# Altium project ArakDisCharger.PrjPcb (part 1 of 2)
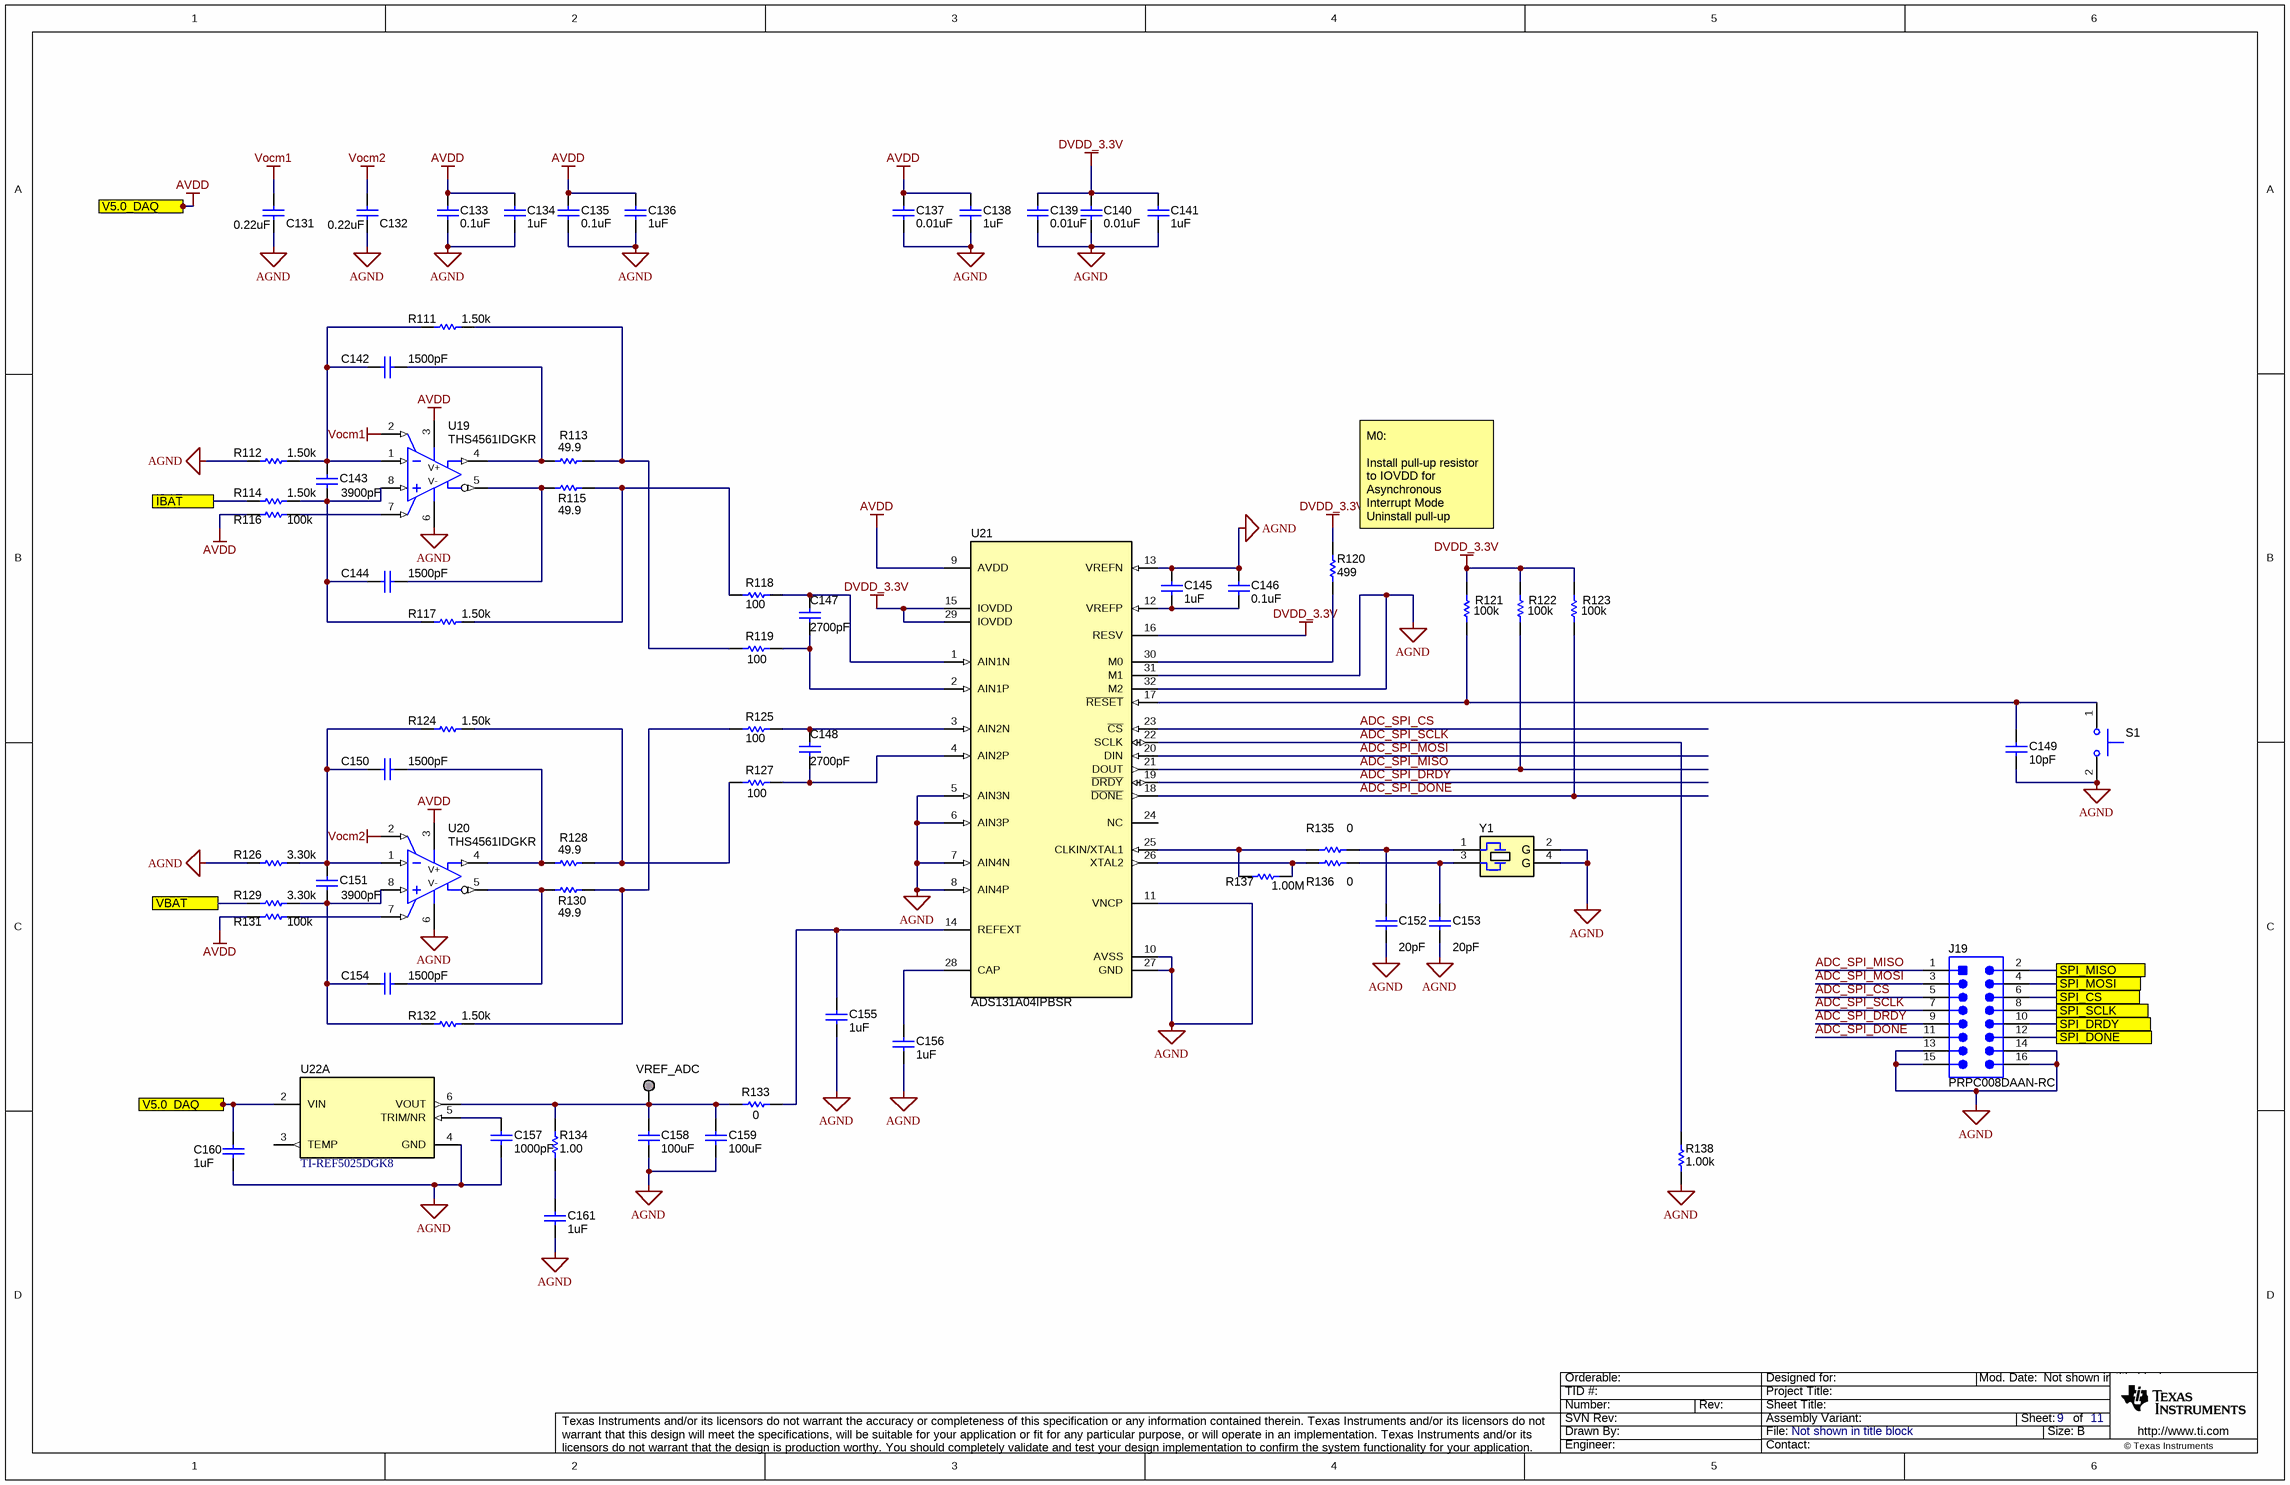
[diagram p0: Arak-ADC.SchDoc]
6 sheets, 167 parts. Net scope: flat (ports and power ports of the same name join across sheets).
Sheets:
  Arak-ADC.SchDoc
  Arak-AnalogueFrontend.SchDoc
  Arak-DAC.SchDoc
  Arak-Mux.SchDoc
  Arak-18650-Holder.SchDoc
  Arak-SlaveMux.SchDoc

## Sheet Arak-ADC.SchDoc
size 431 x 279 mm; Date: Not shown in title block; ApprovedBy: Not shown in title block; CheckedBy: Not shown in title block; Author: Not shown in title block; CompanyName: Not shown in title block; Engineer: Not shown in title block; Organization: Not shown in title block; Address1: Not shown in title block; Address2: Not shown in title block; Address3: Not shown in title block; Address4: Not shown in title block; DocumentNumber: 9; Revision: Use project parameter SCH_Rev; SheetNumber: 9; SheetTotal: 11; PageSetup: Record=PageOptions|CenterHorizontal=True|CenterVertical=True|PrintScale=1.00|XCorrection=1.00|YCorrection=1.00|PrintKind=0|BorderSize=5000000|LeftOffset=0|BottomOffset=0|Orientation=2|PaperLength=1000|PaperWidth=1000|Scale=100|PaperSource=15|PrintQuality=600|MediaType=1|DitherType=10|PaperKind=Letter|PrintScaleMode=1; CurrentTime: Not shown in title block; CurrentDate: Not shown in title block; Time: Not shown in title block; DocumentFullPathAndName: Not shown in title block; DocumentName: Not shown in title block; ModifiedDate: Not shown in title block; ImagePath: Not shown in title block

### Parts
C131  ValueDisplayed: 0.22uF  [0603]  (hidden comment: Capacitor)
C132  ValueDisplayed: 0.22uF  [0603]  (hidden comment: Capacitor)
C133  ValueDisplayed: 0.1uF  [0603]  (hidden comment: Capacitor)
C134  ValueDisplayed: 1uF  [0603]  (hidden comment: Capacitor)
C135  ValueDisplayed: 0.1uF  [0603]  (hidden comment: Capacitor)
C136  ValueDisplayed: 1uF  [0603]  (hidden comment: Capacitor)
C137  ValueDisplayed: 0.01uF  [0603]  (hidden comment: Capacitor)
C138  ValueDisplayed: 1uF  [0603]  (hidden comment: Capacitor)
C139  ValueDisplayed: 0.01uF  [0603]  (hidden comment: Capacitor)
C140  ValueDisplayed: 0.01uF  [0603]  (hidden comment: Capacitor)
C141  ValueDisplayed: 1uF  [0603]  (hidden comment: Capacitor)
C142  ValueDisplayed: 1500pF  [0603]  (hidden comment: Capacitor)
C143  ValueDisplayed: 3900pF  [0603]  (hidden comment: GRM188R72A392KA01D)
C144  ValueDisplayed: 1500pF  [0603]  (hidden comment: Capacitor)
C145  ValueDisplayed: 1uF  [0603]  (hidden comment: Capacitor)
C146  ValueDisplayed: 0.1uF  [0603]  (hidden comment: Capacitor)
C147  ValueDisplayed: 2700pF  [0603]  (hidden comment: Capacitor)
C148  ValueDisplayed: 2700pF  [0603]  (hidden comment: Capacitor)
C149  ValueDisplayed: 10pF  [0603]  (hidden comment: Capacitor)
C150  ValueDisplayed: 1500pF  [0603]  (hidden comment: Capacitor)
C151  ValueDisplayed: 3900pF  [0603]  (hidden comment: GRM188R72A392KA01D)
C152  ValueDisplayed: 20pF  [0603]  (hidden comment: GRM1885C1H200JA01D)
C153  ValueDisplayed: 20pF  [0603]  (hidden comment: GRM1885C1H200JA01D)
C154  ValueDisplayed: 1500pF  [0603]  (hidden comment: Capacitor)
C155  ValueDisplayed: 1uF  [0603]  (hidden comment: Capacitor)
C156  ValueDisplayed: 1uF  [0603]  (hidden comment: Capacitor)
C157  ValueDisplayed: 1000pF  [0603]  (hidden comment: Capacitor)
C158  ValueDisplayed: 100uF  [1206_190]  (hidden comment: Capacitor)
C159  ValueDisplayed: 100uF  [1206_190]  (hidden comment: Capacitor)
C160  ValueDisplayed: 1uF  [0603]  (hidden comment: Capacitor)
C161  ValueDisplayed: 1uF  [0603]  (hidden comment: Capacitor)
J19  PRPC008DAAN-RC  [Sullins_xxxC008DAAN]
R111  ValueDisplayed: 1.50k  [0603]  (hidden comment: RC0603FR-071K5L)
R112  ValueDisplayed: 1.50k  [0603]  (hidden comment: RC0603FR-071K5L)
R113  ValueDisplayed: 49.9  [0603]  (hidden comment: Resistor)
R114  ValueDisplayed: 1.50k  [0603]  (hidden comment: RC0603FR-071K5L)
R115  ValueDisplayed: 49.9  [0603]  (hidden comment: Resistor)
R116  ValueDisplayed: 100k  [0603]  (hidden comment: Resistor)
R117  ValueDisplayed: 1.50k  [0603]  (hidden comment: RC0603FR-071K5L)
R118  ValueDisplayed: 100  [0603]  (hidden comment: Resistor)
R119  ValueDisplayed: 100  [0603]  (hidden comment: Resistor)
R120  ValueDisplayed: 499  [0603]  (hidden comment: Resistor)
R121  ValueDisplayed: 100k  [0603]  (hidden comment: Resistor)
R122  ValueDisplayed: 100k  [0603]  (hidden comment: Resistor)
R123  ValueDisplayed: 100k  [0603]  (hidden comment: Resistor)
R124  ValueDisplayed: 1.50k  [0603]  (hidden comment: RC0603FR-071K5L)
R125  ValueDisplayed: 100  [0603]  (hidden comment: Resistor)
R126  ValueDisplayed: 3.30k  [0603]  (hidden comment: RC0603FR-073K3L)
R127  ValueDisplayed: 100  [0603]  (hidden comment: Resistor)
R128  ValueDisplayed: 49.9  [0603]  (hidden comment: Resistor)
R129  ValueDisplayed: 3.30k  [0603]  (hidden comment: RC0603FR-073K3L)
R130  ValueDisplayed: 49.9  [0603]  (hidden comment: Resistor)
R131  ValueDisplayed: 100k  [0603]  (hidden comment: Resistor)
R132  ValueDisplayed: 1.50k  [0603]  (hidden comment: RC0603FR-071K5L)
R133  ValueDisplayed: 0  [0603]  (hidden comment: Resistor)
R134  ValueDisplayed: 1.00  [0603]  (hidden comment: Resistor)
R135  ValueDisplayed: 0  [0603]  (hidden comment: Resistor)
R136  ValueDisplayed: 0  [0603]  (hidden comment: Resistor)
R137  ValueDisplayed: 1.00M  [0603]  (hidden comment: Resistor)
R138  ValueDisplayed: 1.00k  [0603]  (hidden comment: Resistor)
S1  Switch_PushButton  [SW_TL1015AF160QG]  (value not drawn)
U19  THS4561IDGKR  [DGK0008A_N]
U20  THS4561IDGKR  [DGK0008A_N]
U21  ADS131A04IPBSR  [PBS0032A_L]
U22  TI-REF5025DGK8  [DGK0008A_N]  (part A of 2)
VREF_ADC  Pogo Pad  [PogoPad]  (value not drawn)  (no BOM)
Y1  XTAL_4P_13_G24  [CTS_407]  (value not drawn)

### Ports
IBAT, SPI_CS, SPI_DONE, SPI_DRDY, SPI_MISO, SPI_MOSI, SPI_SCLK, V5.0_DAQ, VBAT

### Nets
AGND: C131.2 C132.2 C133.2 C134.2 C135.2 C136.2 C137.2 C138.2 C139.2 C140.2 C141.2 C145.1 C146.1 C149.1 C152.2 C153.2 C155.2 C156.2 C157.2 C158.2 C159.2 C160.2 C161.2 J19.13 J19.14 J19.15 J19.16 R112.1 R126.1 R138.1 S1.2 U19.6(VS-) U20.6(VS-) U21.5(AIN3N) U21.6(AIN3P) U21.7(AIN4N) U21.8(AIN4P) U21.10(AVSS) U21.11(VNCP) U21.13(VREFN) U21.27(GND) U21.31(M1) U21.32(M2) U22.4(GND) Y1.2(GND) Y1.4(GND)
AVDD: C133.1 C134.1 C135.1 C136.1 C137.1 C138.1 C160.1 R116.2 R131.2 U19.3(VS+) U20.3(VS+) U21.9(AVDD) U22.2(VIN) ; port V5.0_DAQ
DVDD_3.3V: C139.1 C140.1 C141.1 R120.2 R121.2 R122.2 R123.2 U21.15(IOVDD) U21.16(RESV) U21.29(IOVDD)
Vocm1: C131.1 U19.2(VOCM)
Vocm2: C132.1 U20.2(VOCM)
ADC_SPI_CS: J19.5 U21.23(~{CS})
ADC_SPI_DONE: J19.11 R123.1 U21.18(~{DONE})
ADC_SPI_DRDY: J19.9 U21.19(~{DRDY})
ADC_SPI_MISO: J19.1 R122.1 U21.21(DOUT)
ADC_SPI_MOSI: J19.3 U21.20(DIN)
ADC_SPI_SCLK: J19.7 R138.2 U21.22(SCLK)
NetC8_2: R129.1 ; port VBAT
NetC113_2: R114.1 ; port IBAT
NetC142_1: C142.1 C143.1 R111.1 R112.2 U19.1(VIN-)
NetC142_2: C142.2 R113.1 U19.4(VOUT+)
NetC143_2: C143.2 C144.1 R114.2 R117.1 U19.8(VIN+)
NetC144_2: C144.2 R115.1 U19.5(VOUT-)
NetC145_2: C145.2 C146.2 U21.12(VREFP)
NetC147_1: C147.1 R118.2 U21.1(AIN1N)
NetC147_2: C147.2 R119.2 U21.2(AIN1P)
NetC148_1: C148.1 R125.2 U21.3(AIN2N)
NetC148_2: C148.2 R127.2 U21.4(AIN2P)
NetC149_2: C149.2 R121.1 S1.1 U21.17(~{RESET})
NetC150_1: C150.1 C151.1 R124.1 R126.2 U20.1(VIN-)
NetC150_2: C150.2 R128.1 U20.4(VOUT+)
NetC151_2: C151.2 C154.1 R129.2 R132.1 U20.8(VIN+)
NetC152_1: C152.1 R135.2 Y1.1
NetC153_1: C153.1 R136.1 Y1.3
NetC154_2: C154.2 R130.1 U20.5(VOUT-)
NetC155_1: C155.1 R133.2 U21.14(REFEXT)
NetC156_1: C156.1 U21.28(CAP)
NetC157_1: C157.1 U22.5(TRIM/NR)
NetC158_1: C158.1 C159.1 R133.1 R134.2 U22.6(VOUT) VREF_ADC.1
NetC161_1: C161.1 R134.1
NetJ19_2: J19.2 ; port SPI_MISO
NetJ19_4: J19.4 ; port SPI_MOSI
NetJ19_6: J19.6 ; port SPI_CS
NetJ19_8: J19.8 ; port SPI_SCLK
NetJ19_10: J19.10 ; port SPI_DRDY
NetJ19_12: J19.12 ; port SPI_DONE
NetR111_2: R111.2 R113.2 R119.1
NetR115_2: R115.2 R117.2 R118.1
NetR116_1: R116.1 U19.7(~{PD})
NetR120_1: R120.1 U21.30(M0)
NetR124_2: R124.2 R127.1 R128.2
NetR125_1: R125.1 R130.2 R132.2
NetR131_1: R131.1 U20.7(~{PD})
NetR135_1: R135.1 R137.2 U21.25(CLKIN/XTAL1)
NetR136_2: R136.2 R137.1 U21.26(XTAL2)

Not connected (* = marked no-connect by the designer): U21 24(NC); U22 3(TEMP)

### Notes on the sheet
- (near R120) M0:
  Install pull-up resistor to IOVDD for Asynchronous Interrupt Mode
  Uninstall pull-up resistor to leave M0 floating for Synchronous Slave Mode
- Drawn By:
- SVN Rev:
- Number:
- TID #:
- Orderable:
- Rev:
- Sheet Title:
- File:
- Project Title:
- Designed for:
- Assembly Variant:
- Mod. Date:
- Sheet:
- Size:
- of
- B
- http://www.ti.com
- Texas Instruments and/or its licensors do not warrant the accuracy or completeness of this specification or any information contained therein. Texas Instruments and/or its licensors do not warrant that this design will meet the specifications, will be suitable for your application or fit for any particular purpose, or will operate in an implementation. Texas Instruments and/or its licensors do not warrant that the design is production worthy. You should completely validate and test your design implementation to confirm the system functionality for your application.
- Engineer:
- Contact:
- © Texas Instruments
- (in symbol CMP-0004606-3) G
- (in symbol CMP-0074888-1) V+; V-

### Library data of the parts
C131 C132 = CMP-0006903-4: CAP, CERM, 0.22 uF, 16 V, +/- 10%, X7R, 0603; PartNumber: C0603C224K4RACTU; Manufacturer: Kemet; Polarized: N; Value: 0.22uF; U/M: EA; Cap_F: 220nF; Value1: Unknown; VDC_V: 16V; TaMin_C: -55°C; TaMax_C: 125°C; AEC Category: Q200; SizeArea_mm2: 1.28; SizeAreaWB_mm2: 4.68; SizeX_mm: 1.6; SizeY_mm: 0.8; SizeZ_mm: 1; CompType: Capacitor; PackageReference: 0603; RoHS: Y; Tolerance_%: 10%; Value2: 16V; MountType: SMT; Technology: Ceramic; TempCo: X7R; Cap_Case: 0603; Published: 2008-06-19; Publisher: Texas Instruments; LatestRevisionDate: 2017-03-09; ComponentLink1Description: Datasheet link; ComponentLink1URL: http://www.kemet.com/kemet/web/homepage/kechome.nsf/vapubfiles/F3102_Y5V.pdf/$file/F3102_Y5V.pdf; Supplier 1: Digi-Key; Supplier Part Number 1: 399-5619-1-ND; Supplier 2: Mouser; Supplier Part Number 2: 80-C0603C224K4R; Supplier 3: Farnell; Supplier Part Number 3: 1650007; AEC Qualified: ?
C133 C135 C146 = CMP-0006752-5: CAP, CERM, 0.1 uF, 25 V, +/- 5%, X7R, 0603; PartNumber: 06033C104JAT2A; Manufacturer: AVX; Polarized: N; Value: 0.1uF; U/M: EA; Cap_F: 100nF; ESR_ohm: 0.05; Value1: 0.05 ohm; VDC_V: 25V; TaMin_C: -55°C; TaMax_C: 125°C; AEC Category: Q200; SizeArea_mm2: 1.28; SizeAreaWB_mm2: 4.68; SizeX_mm: 1.6; SizeY_mm: 0.8; SizeZ_mm: 1; CompType: Capacitor; PackageReference: 0603; RoHS: Y; Tolerance_%: 5%; Value2: 25V; MountType: SMT; Technology: Ceramic; TempCo: X7R; Cap_Case: 0603; Published: 2008-06-19; Publisher: Texas Instruments; LatestRevisionDate: 2017-03-09; ComponentLink1Description: Datasheet link; ComponentLink1URL: http://datasheets.avx.com/X7RDielectric.pdf; Supplier 1: Digi-Key; Supplier Part Number 1: 478-3713-1-ND; Supplier 2: Mouser; Supplier Part Number 2: 581-06033C104JAT2A; Supplier 3: Farnell; Supplier Part Number 3: 1740614; AEC Qualified: N; AEC Grade: N/A
C134 C136 C138 C141 C145 C155 C156 C160 C161 = CMP-0007405-4: CAP, CERM, 1 uF, 25 V, +/- 10%, X7R, 0603; PartNumber: GRM188R71E105KA12D; Manufacturer: MuRata; Polarized: N; Value: 1uF; U/M: EA; Cap_F: 1µF; Value1: Unknown; VDC_V: 25V; TaMin_C: -55°C; TaMax_C: 125°C; AEC Category: Q200; SizeArea_mm2: 1.28; SizeAreaWB_mm2: 4.68; SizeX_mm: 1.6; SizeY_mm: 0.8; SizeZ_mm: 1; CompType: Capacitor; PackageReference: 0603; RoHS: Y; Tolerance_%: 10%; Value2: 25V; MountType: SMT; Technology: Ceramic; TempCo: X7R; Cap_Case: 0603; Published: 2008-06-19; Publisher: Texas Instruments; LatestRevisionDate: 2017-03-09; ComponentLink1Description: Datasheet link; ComponentLink1URL: http://search.murata.co.jp/Ceramy/PnsearchViewAction.do?HnOFG=ON&HnNFG=ON&SEL_CNT=50&sLang=en&sKey=GRM188R71E105KA12D&x=9&y=9&search=startwith; Supplier 1: Digi-Key; Supplier Part Number 1: 490-5307-1-ND; Supplier 2: Mouser; Supplier Part Number 2: 81-GRM188R71E105KA2D; Supplier 3: Farnell; Supplier Part Number 3: 1735540; AEC Qualified: ?
C137 C139 C140 = CMP-0006727-4: CAP, CERM, 0.01 uF, 100 V, +/- 10%, X7R, 0603; PartNumber: 06031C103KAT2A; Manufacturer: AVX; Polarized: N; Value: 0.01uF; U/M: EA; Cap_F: 10nF; ESR_ohm: 0.098; Value1: 0.098 ohm; VDC_V: 100V; TaMin_C: -55°C; TaMax_C: 125°C; AEC Category: Q200; SizeArea_mm2: 1.28; SizeAreaWB_mm2: 4.68; SizeX_mm: 1.6; SizeY_mm: 0.8; SizeZ_mm: 1; CompType: Capacitor; PackageReference: 0603; RoHS: Y; Tolerance_%: 10%; Value2: 100V; MountType: SMT; Technology: Ceramic; TempCo: X7R; Cap_Case: 0603; Published: 2008-06-19; Publisher: Texas Instruments; LatestRevisionDate: 2017-03-09; ComponentLink1Description: Datasheet link; ComponentLink1URL: http://datasheets.avx.com/X7RDielectric.pdf; Supplier 1: Digi-Key; Supplier Part Number 1: 478-1205-1-ND; Supplier 2: Newark; Supplier Part Number 2: 96K4758; Supplier 3: Mouser; Supplier Part Number 3: 581-06031C103K; AEC Qualified: N; AEC Grade: N/A
C142 C144 C150 C154 = CMP-0006732-4: CAP, CERM, 1500 pF, 100 V, +/- 5%, X7R, 0603; PartNumber: 06031C152JAT2A; Manufacturer: AVX; Polarized: N; Value: 1500pF; U/M: EA; Cap_F: 1.5nF; ESR_ohm: 2.29d; Value1: 0.229 ohm; VDC_V: 100V; TaMin_C: -55°C; TaMax_C: 125°C; AEC Category: Q200; SizeArea_mm2: 1.28; SizeAreaWB_mm2: 4.68; SizeX_mm: 1.6; SizeY_mm: 0.8; SizeZ_mm: 1; CompType: Capacitor; PackageReference: 0603; RoHS: Y; Tolerance_%: 5%; Value2: 100V; MountType: SMT; Technology: Ceramic; TempCo: X7R; Cap_Case: 0603; Published: 2008-06-19; Publisher: Texas Instruments; LatestRevisionDate: 2017-03-09; ComponentLink1Description: Datasheet link; ComponentLink1URL: http://datasheets.avx.com/X7RDielectric.pdf; Supplier 1: Digi-Key; Supplier Part Number 1: 478-3703-1-ND; Supplier 2: Newark; Supplier Part Number 2: 96M1240; Supplier 3: Mouser; Supplier Part Number 3: 581-06031C152JAT2A; AEC Qualified: N; AEC Grade: N/A
C143 C151 = CMP-0007481-5: CAP, CERM, 3900 pF, 100 V, +/- 10%, X7R, 0603; Manufacturer: MuRata; TaMin_C: -55°C; Polarized: N; SizeAreaWB_mm2: 4.68; Value1: Unknown; U/M: EA; Value: 3900pF; TaMax_C: 125°C; SizeZ_mm: 1; SizeX_mm: 1.6; SizeY_mm: 0.8; Value2: 100V; SizeArea_mm2: 1.28; CompType: Capacitor; Cap_F: 3.9nF; AEC Category: Q200; Supplier Part Number 2: 81-GRM188R72A392KA1D; Publisher: Texas Instruments; Supplier 2: Mouser; TempCo: X7R; Published: 2008-06-19; RoHS: Y; MountType: SMT; Supplier 1: Digi-Key; PackageReference: 0603; Tolerance_%: 10%; Cap_Case: 0603; LatestRevisionDate: 2017-03-09; PartNumber: GRM188R72A392KA01D; AEC Qualified: ?; VDC_V: 100V; ComponentLink1Description: Datasheet link; Supplier Part Number 1: GRM188R72A392KA01D-ND; Technology: Ceramic; ComponentLink1URL: http://search.murata.co.jp/Ceramy/PnsearchViewAction.do?HnOFG=ON&HnNFG=ON&SEL_CNT=50&sLang=en&sKey=GRM188R72A392KA01D&x=9&y=9&search=startwith
C147 C148 = CMP-0007204-4: CAP, CERM, 2700 pF, 50 V, +/- 5%, C0G/NP0, 0603; PartNumber: GRM1885C1H272JA01D; Manufacturer: MuRata; Polarized: N; Value: 2700pF; U/M: EA; Cap_F: 2.7nF; Value1: Unknown; VDC_V: 50V; TaMin_C: -55°C; TaMax_C: 125°C; AEC Category: Q200; SizeArea_mm2: 1.28; SizeAreaWB_mm2: 4.68; SizeX_mm: 1.6; SizeY_mm: 0.8; SizeZ_mm: 1; CompType: Capacitor; PackageReference: 0603; RoHS: Y; Tolerance_%: 5%; Value2: 50V; MountType: SMT; Technology: Ceramic; TempCo: C0G/NP0; Cap_Case: 0603; Published: 2008-06-19; Publisher: Texas Instruments; LatestRevisionDate: 2017-03-09; ComponentLink1Description: Datasheet link; ComponentLink1URL: http://search.murata.co.jp/Ceramy/PnsearchViewAction.do?HnOFG=ON&HnNFG=ON&SEL_CNT=50&sLang=en&sKey=GRM1885C1H272JA01D&x=9&y=9&search=startwith; Supplier 1: Digi-Key; Supplier Part Number 1: 490-3283-1-ND; Supplier 2: Mouser; Supplier Part Number 2: 81-GRM185C1H272JA01D; AEC Qualified: ?
C149 = CMP-0006761-4: CAP, CERM, 10 pF, 50 V, +/- 5%, C0G/NP0, 0603; PartNumber: 06035A100JAT2A; Manufacturer: AVX; Polarized: N; Value: 10pF; U/M: EA; ESR_ohm: 4.03d; Value1: 0.403 ohm; VDC_V: 50V; TaMin_C: -55°C; TaMax_C: 125°C; AEC Category: Q200; SizeArea_mm2: 1.28; SizeAreaWB_mm2: 4.68; SizeX_mm: 1.6; SizeY_mm: 0.8; SizeZ_mm: 1; CompType: Capacitor; PackageReference: 0603; RoHS: Y; Cap_F: 10pF; Tolerance_%: 5%; Value2: 50V; MountType: SMT; Technology: Ceramic; TempCo: C0G/NP0; Cap_Case: 0603; Published: 2008-06-19; Publisher: Texas Instruments; LatestRevisionDate: 2017-03-09; ComponentLink1Description: Datasheet link; ComponentLink1URL: http://datasheets.avx.com/C0GNP0-Dielectric.pdf; Supplier 1: Digi-Key; Supplier Part Number 1: 478-1163-1-ND; Supplier 2: Newark; Supplier Part Number 2: 17C6435; Supplier 3: Mouser; Supplier Part Number 3: 581-06035A100J; AEC Qualified: N; AEC Grade: N/A
C152 C153 = CMP-0007193-4: CAP, CERM, 20 pF, 50 V, +/- 5%, C0G/NP0, 0603; Manufacturer: MuRata; TaMin_C: -55°C; Polarized: N; SizeAreaWB_mm2: 4.68; Value1: Unknown; U/M: EA; Value: 20pF; TaMax_C: 125°C; SizeZ_mm: 1; SizeX_mm: 1.6; SizeY_mm: 0.8; Value2: 50V; SizeArea_mm2: 1.28; CompType: Capacitor; AEC Category: Q200; Supplier Part Number 2: 81-GRM39C200J50; Publisher: Texas Instruments; Supplier 2: Mouser; TempCo: C0G/NP0; Published: 2008-06-19; RoHS: Y; MountType: SMT; Supplier 1: Digi-Key; PackageReference: 0603; Tolerance_%: 5%; Cap_Case: 0603; LatestRevisionDate: 2017-03-09; PartNumber: GRM1885C1H200JA01D; AEC Qualified: ?; Cap_F: 20pF; VDC_V: 50V; ComponentLink1Description: Datasheet link; Supplier Part Number 1: 490-1410-1-ND; Technology: Ceramic; ComponentLink1URL: http://search.murata.co.jp/Ceramy/PnsearchViewAction.do?HnOFG=ON&HnNFG=ON&SEL_CNT=50&sLang=en&sKey=GRM1885C1H200JA01D&x=9&y=9&search=startwith
C157 = CMP-0006723-4: CAP, CERM, 1000 pF, 100 V, +/- 5%, X7R, 0603; PartNumber: 06031C102JAT2A; Manufacturer: AVX; Polarized: N; Value: 1000pF; U/M: EA; Cap_F: 1nF; ESR_ohm: 2.76d; Value1: 0.276 ohm; VDC_V: 100V; TaMin_C: -55°C; TaMax_C: 125°C; AEC Category: Q200; SizeArea_mm2: 1.28; SizeAreaWB_mm2: 4.68; SizeX_mm: 1.6; SizeY_mm: 0.8; SizeZ_mm: 1; CompType: Capacitor; PackageReference: 0603; RoHS: Y; Tolerance_%: 5%; Value2: 100V; MountType: SMT; Technology: Ceramic; TempCo: X7R; Cap_Case: 0603; Published: 2008-06-19; Publisher: Texas Instruments; LatestRevisionDate: 2017-03-09; ComponentLink1Description: Datasheet link; ComponentLink1URL: http://datasheets.avx.com/X7RDielectric.pdf; Supplier 1: Digi-Key; Supplier Part Number 1: 478-3698-1-ND; Supplier 2: Newark; Supplier Part Number 2: 96M1234; Supplier 3: Mouser; Supplier Part Number 3: 581-06031C102J; AEC Qualified: N; AEC Grade: N/A
C158 C159 = CMP-0008649-2: CAP, CERM, 100 uF, 10 V, +/- 20%, X5R, 1206_190; PartNumber: C3216X5R1A107M160AC; Manufacturer: TDK; Polarized: N; Value: 100uF; U/M: EA; Cap_F: 100µF; ESR_ohm: 2.838m; Value1: 0.002838 ohm; VDC_V: 10V; IRMS_A: 4.30694A; TaMin_C: -55°C; TaMax_C: 85°C; AEC Category: Q200; SizeArea_mm2: 5.12; SizeAreaWB_mm2: 10.92; SizeX_mm: 3.2; SizeY_mm: 1.6; SizeZ_mm: 1.9; CompType: Capacitor; PackageReference: 1206_190; RoHS: Y; Tolerance_%: 20%; Value2: 10V; MountType: SMT; Technology: Ceramic; TempCo: X5R; Cap_Case: 1206_190; Published: 2008-06-19; Publisher: Texas Instruments; LatestRevisionDate: 2017-03-09; ComponentLink1Description: Datasheet link; ComponentLink1URL: https://product.tdk.com/en/search/capacitor/ceramic/mlcc/info?part_no=C3216X5R1A107M160AC; Supplier 1: Digi-Key; Supplier Part Number 1: 445-6007-1-ND; Supplier 2: Newark; Supplier Part Number 2: 12T1945; Supplier 3: Mouser; Supplier Part Number 3: 810-C3216X5R1A107M; AEC Qualified: N; AEC Grade: N/A
J19 = CMP-0054590-1: Header, 2.54mm, 8x2, Gold, TH; Manufacturer: Sullins Connector Solutions; CNHeader: TRUE; Shrouded: N; Gender: Male; Row_Count: 2; RowSpacing_mm: 2.54; CT: FALSE; ComponentLink1URL: http://sullinscorp.com/drawings/294___R__C_____D___N-RC,_11636.pdf; ClassName: Header; Publisher: Texas Instruments; Color: Black; RoHS: Y; MountType: TH; Supplier 1: Digi-Key; PackageReference: Header, 2.54mm, 8x2, TH; PinCount: 16; CompType: Header; LatestRevisionDate: 26/05/2017; PartNumber: PRPC008DAAN-RC; Orientation: Vertical; ComponentLink1Description: Datasheet URL; Supplier Part Number 1: S2011EC-08-ND; Pitch_mm: 2.54; ContactFinish: Gold
R111 R112 R114 R117 R124 = CMP-0022883-3: RES, 1.50 k, 1%, 0.1 W, 0603; Manufacturer: Yageo America; Power_W: 100mW; TempCo: 200 ppm/C; Value_Code: 1k50; U/M: EA; Value: 1.50k; EIA_Code: E96; Res_ohm: 1.5k; SizeX_mm: 1.6; SizeY_mm: 0.8; SizeZ_mm: 1; Value2: 0.1W; SizeArea_mm2: 1.28; CompType: Resistor; VDC_V: 150V; AEC Category: Q200; Supplier Part Number 2: 603-RC0603FR-071K5L; Publisher: Texas Instruments; Supplier 2: Mouser; Supplier Part Number 3: 9238506; Supplier 3: Farnell; Published: 2008-06-26; RoHS: Y; Value1: 1%; MountType: SMT; Supplier 1: Digi-Key; PackageReference: 0603; Tolerance_%: 1%; LatestRevisionDate: 2017-03-09; PartNumber: RC0603FR-071K5L; AEC Qualified: ?; ComponentLink1Description: Datasheet link; Supplier Part Number 1: 311-1.50KHRCT-ND; Technology: Thick Film; ComponentLink1URL: http://www.yageo.com/pdf/Pu-RC0603_51_PbFree_L_2.pdf
R113 R115 R128 R130 = CMP-0022448-4: RES, 49.9, 1%, 0.1 W, AEC-Q200 Grade 0, 0603; PartNumber: CRCW060349R9FKEA; Manufacturer: Vishay-Dale; Value: 49.9; Value_Code: 49R9; Power_W: 100mW; Value2: 0.1W; VDC_V: 75V; TempCo: 100 ppm/C; EIA_Code: E96; AEC Category: Q200; AEC Qualified: Y; AEC Grade: 0; SizeArea_mm2: 1.28; SizeX_mm: 1.6; SizeY_mm: 0.8; SizeZ_mm: 1; CompType: Resistor; PackageReference: 0603; RoHS: E; Res_ohm: 49.9; Tolerance_%: 1%; Value1: 1%; MountType: SMT; Technology: Thick Film; ComponentLink1Description: Datasheet link; ComponentLink1URL: http://www.vishay.com/docs/20035/dcrcwe3.pdf; Supplier 1: Digi-Key; Supplier Part Number 1: 541-49.9HCT-ND; Supplier 2: Newark; Supplier Part Number 2: 52K8566; Supplier 3: Mouser; Supplier Part Number 3: 71-CRCW0603-49.9-E3
R116 R121-R123 R131 = CMP-0021990-4: RES, 100 k, 1%, 0.1 W, AEC-Q200 Grade 0, 0603; PartNumber: CRCW0603100KFKEA; Manufacturer: Vishay-Dale; Value: 100k; Power_W: 100mW; Value2: 0.1W; VDC_V: 75V; TempCo: 100 ppm/C; EIA_Code: E96; AEC Category: Q200; AEC Qualified: Y; AEC Grade: 0; SizeArea_mm2: 1.28; SizeX_mm: 1.6; SizeY_mm: 0.8; SizeZ_mm: 1; CompType: Resistor; PackageReference: 0603; RoHS: E; Res_ohm: 100k; Value_Code: 100k; Tolerance_%: 1%; Value1: 1%; MountType: SMT; Technology: Thick Film; ComponentLink1Description: Datasheet link; ComponentLink1URL: http://www.vishay.com/docs/20035/dcrcwe3.pdf; Supplier 1: Digi-Key; Supplier Part Number 1: 541-100KHCT-ND; Supplier 2: Newark; Supplier Part Number 2: 42K3668; Supplier 3: Mouser; Supplier Part Number 3: 71-CRCW0603-100K-E3
R118 R119 R125 R127 = CMP-0021991-4: RES, 100, 1%, 0.1 W, AEC-Q200 Grade 0, 0603; PartNumber: CRCW0603100RFKEA; Manufacturer: Vishay-Dale; Value: 100; Value_Code: 100R; Power_W: 100mW; Value2: 0.1W; VDC_V: 75V; TempCo: 100 ppm/C; EIA_Code: E96; AEC Category: Q200; AEC Qualified: Y; AEC Grade: 0; SizeArea_mm2: 1.28; SizeX_mm: 1.6; SizeY_mm: 0.8; SizeZ_mm: 1; CompType: Resistor; PackageReference: 0603; RoHS: E; Res_ohm: 100; Tolerance_%: 1%; Value1: 1%; MountType: SMT; Technology: Thick Film; ComponentLink1Description: Datasheet link; ComponentLink1URL: http://www.vishay.com/docs/20035/dcrcwe3.pdf; Supplier 1: Digi-Key; Supplier Part Number 1: 541-100HCT-ND; Supplier 2: Newark; Supplier Part Number 2: 52K8078; Supplier 3: Mouser; Supplier Part Number 3: 71-CRCW0603-100-E3
R120 = CMP-0022446-5: RES, 499, 1%, 0.1 W, AEC-Q200 Grade 0, 0603; PartNumber: CRCW0603499RFKEA; Manufacturer: Vishay-Dale; Value: 499; Value_Code: 499R; Power_W: 100mW; Value2: 0.1W; VDC_V: 75V; TempCo: 100 ppm/C; EIA_Code: E96; AEC Category: Q200; AEC Qualified: Y; AEC Grade: 0; SizeArea_mm2: 1.28; SizeX_mm: 1.6; SizeY_mm: 0.8; SizeZ_mm: 1; CompType: Resistor; PackageReference: 0603; RoHS: E; Res_ohm: 499; Tolerance_%: 1%; Value1: 1%; MountType: SMT; Technology: Thick Film; ComponentLink1Description: Datasheet link; ComponentLink1URL: http://www.vishay.com/docs/20035/dcrcwe3.pdf; Supplier 1: Digi-Key; Supplier Part Number 1: 541-499HCT-ND; Supplier 2: Newark; Supplier Part Number 2: 52K8569; Supplier 3: Mouser; Supplier Part Number 3: 71-CRCW0603-499-E3
R126 R129 = CMP-0023081-3: RES, 3.30 k, 1%, 0.1 W, 0603; Manufacturer: Yageo America; Power_W: 100mW; TempCo: 200 ppm/C; Value_Code: 3k30; U/M: EA; Value: 3.30k; Res_ohm: 3.3k; SizeX_mm: 1.6; SizeY_mm: 0.8; SizeZ_mm: 1; Value2: 0.1W; SizeArea_mm2: 1.28; VDC_V: 150V; AEC Category: Q200; Supplier Part Number 2: 603-RC0603FR-073K3L; Publisher: Texas Instruments; Supplier 2: Mouser; Supplier Part Number 3: 9238549; Supplier 3: Farnell; Published: 2008-06-26; RoHS: Y; Value1: 1%; MountType: SMT; Supplier 1: Digi-Key; PackageReference: 0603; Tolerance_%: 1%; CompType: Resistor; LatestRevisionDate: 2017-03-09; PartNumber: RC0603FR-073K3L; AEC Qualified: ?; ComponentLink1Description: Datasheet link; Supplier Part Number 1: 311-3.30KHRCT-ND; Technology: Thick Film; ComponentLink1URL: http://www.yageo.com/pdf/Pu-RC0603_51_PbFree_L_2.pdf
R132 = CMP-0022883-3: RES, 1.50 k, 1%, 0.1 W, 0603; Manufacturer: Yageo America; Power_W: 100mW; TempCo: 200 ppm/C; Value_Code: 1k50; U/M: EA; Value: 1.50k; EIA_Code: E96; Res_ohm: 1.5k; SizeX_mm: 1.6; SizeY_mm: 0.8; SizeZ_mm: 1; Value2: 0.1W; SizeArea_mm2: 1.28; VDC_V: 150V; AEC Category: Q200; Supplier Part Number 2: 603-RC0603FR-071K5L; Publisher: Texas Instruments; Supplier 2: Mouser; Supplier Part Number 3: 9238506; Supplier 3: Farnell; Published: 2008-06-26; RoHS: Y; Value1: 1%; MountType: SMT; Supplier 1: Digi-Key; PackageReference: 0603; Tolerance_%: 1%; CompType: Resistor; LatestRevisionDate: 2017-03-09; PartNumber: RC0603FR-071K5L; AEC Qualified: ?; ComponentLink1Description: Datasheet link; Supplier Part Number 1: 311-1.50KHRCT-ND; Technology: Thick Film; ComponentLink1URL: http://www.yageo.com/pdf/Pu-RC0603_51_PbFree_L_2.pdf
R133 R135 R136 = CMP-0025874-3: RES, 0, 5%, 0.1 W, 0603; PartNumber: ERJ-3GEY0R00V; Manufacturer: Panasonic; Value: 0; Value_Code: 0000; Power_W: 100mW; Value2: 0.1W; VDC_V: 50V; TempCo: 600 ppm/C; EIA_Code: E24; U/M: EA; AEC Category: Q200; SizeArea_mm2: 1.28; SizeX_mm: 1.6; SizeY_mm: 0.8; SizeZ_mm: 1; CompType: Resistor; PackageReference: 0603; RoHS: Y; Res_ohm: 0; Tolerance_%: 5%; Value1: 5%; MountType: SMT; Technology: Thick Film; Published: 2008-06-26; Publisher: Texas Instruments; LatestRevisionDate: 2017-03-09; ComponentLink1Description: Datasheet link; ComponentLink1URL: http://www.panasonic.com/industrial/components/pdf/AOA0000CE1.pdf; Supplier 1: Digi-Key; Supplier Part Number 1: P0.0GCT-ND; Supplier 2: Mouser; Supplier Part Number 2: 667-ERJ-3GEY0R00V; Supplier 3: Farnell; Supplier Part Number 3: 2059527; AEC Qualified: ?
R134 = CMP-0022170-4: RES, 1.00, 1%, 0.1 W, AEC-Q200 Grade 0, 0603; PartNumber: CRCW06031R00FKEA; Manufacturer: Vishay-Dale; Value: 1.00; Res_ohm: 1; Value_Code: 1R00; Power_W: 100mW; Value2: 0.1W; VDC_V: 75V; TempCo: 100 ppm/C; EIA_Code: E96; AEC Category: Q200; AEC Qualified: Y; AEC Grade: 0; SizeArea_mm2: 1.28; SizeX_mm: 1.6; SizeY_mm: 0.8; CompType: Resistor; PackageReference: 0603; RoHS: E; Tolerance_%: 1%; Value1: 1%; MountType: SMT; Technology: Thick Film; ComponentLink1Description: Datasheet link; ComponentLink1URL: http://www.vishay.com/docs/20035/dcrcwe3.pdf; Supplier 1: Newark; Supplier Part Number 1: 52K8059; Supplier 2: Mouser; Supplier Part Number 2: 71-CRCW06031R00FKEA; Supplier 3: Farnell; Supplier Part Number 3: 1616871; SizeZ_mm: 1
R137 = CMP-0022138-4: RES, 1.00 M, 1%, 0.1 W, AEC-Q200 Grade 0, 0603; PartNumber: CRCW06031M00FKEA; Manufacturer: Vishay-Dale; Value: 1.00Meg; Res_ohm: 1M; Value_Code: 1M00; Power_W: 100mW; Value2: 0.1W; VDC_V: 75V; TempCo: 100 ppm/C; EIA_Code: E96; AEC Category: Q200; AEC Qualified: Y; AEC Grade: 0; SizeArea_mm2: 1.28; SizeX_mm: 1.6; SizeY_mm: 0.8; SizeZ_mm: 1; CompType: Resistor; PackageReference: 0603; RoHS: E; Tolerance_%: 1%; Value1: 1%; MountType: SMT; Technology: Thick Film; ComponentLink1Description: Datasheet link; ComponentLink1URL: http://www.vishay.com/docs/20035/dcrcwe3.pdf; Supplier 1: Digi-Key; Supplier Part Number 1: 541-1.00MHCT-ND; Supplier 2: Newark; Supplier Part Number 2: 52K8053; Supplier 3: Mouser; Supplier Part Number 3: 71-CRCW0603-1.0M-E3
R138 = CMP-0022109-5: RES, 1.00 k, 1%, 0.1 W, AEC-Q200 Grade 0, 0603; PartNumber: CRCW06031K00FKEA; Manufacturer: Vishay-Dale; Value: 1.00k; Res_ohm: 1k; Value_Code: 1k00; Power_W: 100mW; Value2: 0.1W; VDC_V: 75V; TempCo: 100 ppm/C; EIA_Code: E96; AEC Category: Q200; AEC Qualified: Y; AEC Grade: 0; SizeArea_mm2: 1.28; SizeX_mm: 1.6; SizeY_mm: 0.8; SizeZ_mm: 1; CompType: Resistor; PackageReference: 0603; RoHS: E; Tolerance_%: 1%; Value1: 1%; MountType: SMT; Technology: Thick Film; ComponentLink1Description: Datasheet link; ComponentLink1URL: http://www.vishay.com/docs/20035/dcrcwe3.pdf; Supplier 1: Digi-Key; Supplier Part Number 1: 541-1.00KHCT-ND; Supplier 2: Newark; Supplier Part Number 2: 52K8015; Supplier 3: Mouser; Supplier Part Number 3: 71-CRCW0603-1.0K-E3
S1 = CMP-0002143-3: Switch, Tactile, SPST-NO, 0.05A, 12V, SMT; PartNumber: TL1015AF160QG; Manufacturer: E-Switch; SwitchFunction: Off-Mom; PositionCount: 1; CurrentRating_mA: 50A; MountType: SMT; ComponentLink1Description: Datasheet URL; ComponentLink1URL: http://spec.e-switch.com/P-J/P420000.pdf; RoHS: Y; Circuit: SPST-NO; VDC_V: 12V; Orientation: Top Actuated; CompType: Switch; PackageReference: Switch, 4.4x2x2.9 mm; Publisher: Texas Instruments; LatestRevisionDate: 2017-03-09; Supplier 1: Digi-Key; Supplier Part Number 1: EG4344CT-ND; Supplier 2: Newark; Supplier Part Number 2: 15N4458; Supplier 3: Mouser; Supplier Part Number 3: 612-TL1015AF
U19 U20 = CMP-0074888-1: Low-Power, High Supply Range, 60-MHz, Fully Differential Amplifier, DGK0008A (VSSOP-8); Alternate PartNumber: THS4561IDGKT; Alternate Manufacturer: Texas Instruments; SizeAreaWB_mm2: 35.955; U/M: EA; SizeZ_mm: 1.1; SizeX_mm: 5.05; SizeY_mm: 3.1; SizeArea_mm2: 15.655; CompType: IC; ComponentLink1URL: https://sps06.itg.ti.com/sites/KMS/crossdivteams/altium/docs/ComponentDatasheets/Preview_DS_THS4561.pdf; Publisher: Texas Instruments; PackageDescription: VSSOP-8; MountType: SMT; Manufacturer: Texas Instruments; PackageReference: DGK0008A; LatestRevisionDate: 2017-07-11; PartNumber: THS4561IDGKR; ComponentLink1Description: Datasheet Link
U21 = CMP-0075938-2: 24-Bit, 128kSPS, 4-Ch, Simultaneous Sampling, Delta-Sigma ADC, PBS0032A (TQFP-32); Manufacturer: Texas Instruments; SizeZ_mm: 1.2; SizeX_mm: 7.0; SizeArea_mm2: 49.0; CompType: IC; U/M: EA; SizeAreaWB_mm2: 81.0; ComponentLink1URL: http://www.ti.com/lit/ds/symlink/ads131a04.pdf; Publisher: Texas Instruments; PackageDescription: TQFP-32; SizeY_mm: 7.0; PackageReference: PBS0032A; LatestRevisionDate: 2017-06-09; RoHS: Y; Alternate PartNumber: ADS131A04IPBS; PartNumber: ADS131A04IPBSR; ComponentLink1Description: Datasheet Link; MountType: SMT; Alternate Manufacturer: Texas Instruments
U22 = CMP-0032584-1: Low Noise, Very Low Drift, Precision Voltage Reference, -40 to 125 degC, 8-pin MSOP(DGK), Green (RoHS & no Sb/Br); PartNumber: REF5025IDGKR; Manufacturer: Texas Instruments; Initial Accuracy @ 25/deg C(%): 0.05; Iout/Iz(Max)(mA): 10; Iq(Max)(uA): 1000; Rating: Military; SubFamily: Series Voltage Reference; Temp Coeff(Max)(ppm/ degree C): 3; VI(Max)(V): 18; VI(Min)(V): 2.7; VO(V): 2.5; PackageReference: DGK0008A; ComponentLink1Description: Manufacturer URL; ComponentLink1URL: http://www.ti.com/; Code_JEDEC: MO-187; ComponentLink2Description: Datasheet; ComponentLink2URL: http://www.ti.com/general/docs/lit/getliterature.tsp?genericPartNumber=REF5025&fileType=pdf; ComponentLink3Description: Package Specification; ComponentLink3URL: http://www.ti.com/litv/pdf/mpds028d; DatasheetVersion: SBOS410E; Eco-Plan: Green (RoHS & no Sb/Br); Mounting Technology: Surface Mount; PackageDescription: 8-Pin Thin Small Outline Package 3 x 3 mm Body ,0.65 mm Pitch; PackageVersion: 4073329/E
VREF_ADC = PogoPad: Pad for Pogo Pin Connector; SymbolCreator: codlsc; SymbolVersion: 2010-09-27; PackageReference: N/A; CompType: Pogo Pad; Publisher: Texas Instruments; LatestRevisionDate: 2016-12-05; LatestRevisionNote: Added Alternate PartNumber and Alternate Manufacturer parameters to appropriate components.
Y1 = CMP-0004606-3: Crystal, 16.384 MHz, 20 pF, SMD; PartNumber: 407F35E016M3840; Manufacturer: CTS Electrocomponents; TaMin_C: -20°C; TaMax_C: 70°C; Frequency Stability: +/-50ppm; CompType: Crystal; PackageReference: SMD, 4-Leads, Body 7.2x5.2mm; MountType: SMT; RoHS: Y; ComponentLink1Description: Datasheet Link; ComponentLink1URL: http://www.ctscorp.com/components/Datasheets/008-0261-0_G.pdf; Supplier 1: Digi-Key; Supplier Part Number 1: CTX682CT-ND; Frequency_Fixed: 16.384MHz